# Altium schematic sheet 08 MISC.SchDoc: Misc
size 420 x 297 mm; SheetNumber: 8; SheetTotal: 7
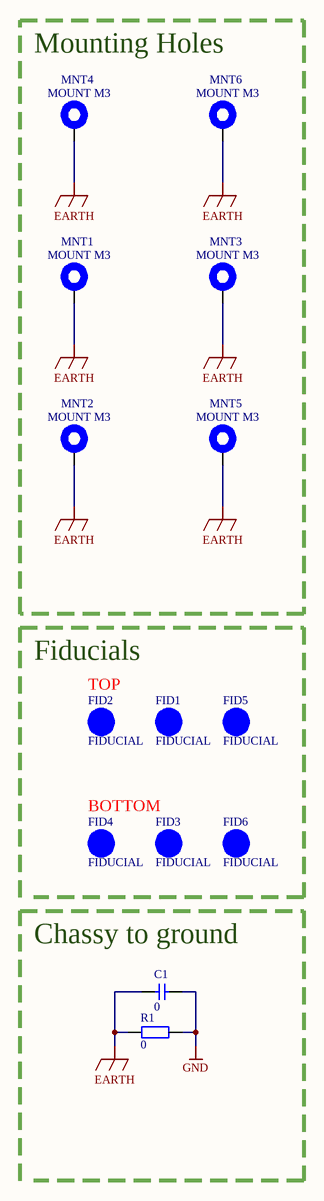
[diagram p0: 08 MISC.SchDoc]

## Parts
C1  0  [CAPC2012X04N]
FID1  FIDUCIAL  [FIDUCIAL]
FID2  FIDUCIAL  [FIDUCIAL]
FID3  FIDUCIAL  [FIDUCIAL]
FID4  FIDUCIAL  [FIDUCIAL]
FID5  FIDUCIAL  [FIDUCIAL]
FID6  FIDUCIAL  [FIDUCIAL]
MNT1  MOUNT M3  [MOUNT_M3]
MNT2  MOUNT M3  [MOUNT_M3]
MNT3  MOUNT M3  [MOUNT_M3]
MNT4  MOUNT M3  [MOUNT_M3]
MNT5  MOUNT M3  [MOUNT_M3]
MNT6  MOUNT M3  [MOUNT_M3]
R1  0  [RESC2012X04N]

## Blocks framed on the sheet
Mounting Holes: MNT1-MNT6

## Nets
EARTH: C1.1 MNT1.1 MNT2.1 MNT3.1 MNT4.1 MNT5.1 MNT6.1 R1.1
GND: C1.2 R1.2

## Notes on the sheet
- Fiducials
- (near FID2) TOP
- BOTTOM
- (near C1) Chassy to ground
- Title
- Project
- Size
- Date
- Revision
- A3
- Designed By

## Library data of the parts
C1 = TEMP_1
MNT1-MNT6 = MOUNT_M3
R1 = TEMP